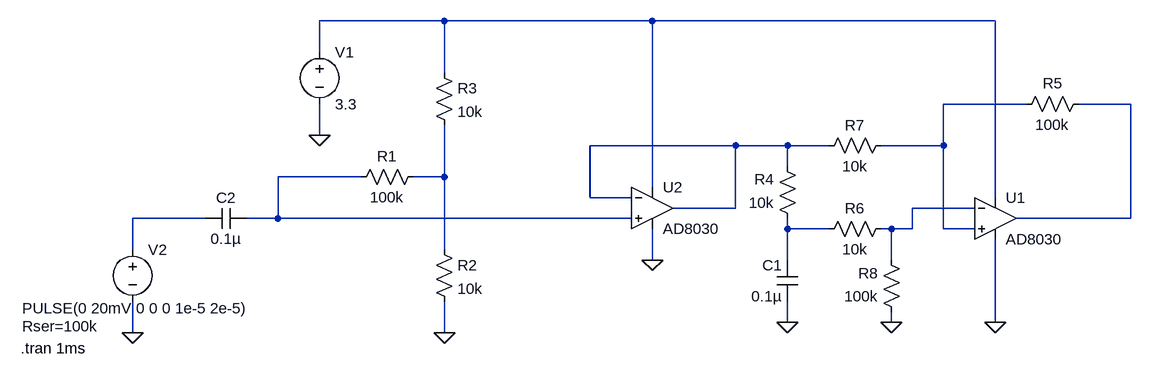
[diagram p0: schematic Draft1.asc]
Draft1.asc, the LTspice schematic file:
Version 4
SHEET 1 1160 680
WIRE -80 -112 -272 -112
WIRE 240 -112 -80 -112
WIRE 768 -112 240 -112
WIRE -272 -64 -272 -112
WIRE -80 -32 -80 -112
WIRE 816 16 688 16
WIRE 976 16 896 16
WIRE -272 64 -272 16
WIRE 368 80 144 80
WIRE 448 80 368 80
WIRE 512 80 448 80
WIRE 688 80 688 16
WIRE 688 80 592 80
WIRE 448 112 448 80
WIRE -208 128 -336 128
WIRE -80 128 -80 48
WIRE -80 128 -128 128
WIRE 240 144 240 -112
WIRE 144 160 144 80
WIRE 208 160 144 160
WIRE 768 160 768 -112
WIRE 368 176 368 80
WIRE 368 176 272 176
WIRE 736 176 640 176
WIRE -448 192 -560 192
WIRE -336 192 -336 128
WIRE -336 192 -384 192
WIRE 208 192 -336 192
WIRE 976 192 976 16
WIRE 976 192 800 192
WIRE 448 208 448 192
WIRE 512 208 448 208
WIRE 608 208 592 208
WIRE 640 208 640 176
WIRE 640 208 608 208
WIRE 688 208 688 80
WIRE 736 208 688 208
WIRE -560 240 -560 192
WIRE -80 240 -80 128
WIRE 240 256 240 208
WIRE 448 256 448 208
WIRE 608 256 608 208
WIRE 448 352 448 320
WIRE 608 352 608 336
WIRE 768 352 768 224
WIRE -560 368 -560 320
WIRE -80 368 -80 320
FLAG -272 64 0
FLAG -560 368 0
FLAG -80 368 0
FLAG 240 256 0
FLAG 768 352 0
FLAG 448 352 0
FLAG 608 352 0
SYMBOL res -96 224 R0
SYMATTR InstName R2
SYMATTR Value 10k
SYMBOL res -96 -48 R0
SYMATTR InstName R3
SYMATTR Value 10k
SYMBOL voltage -272 -80 R0
WINDOW 123 0 0 Left 0
WINDOW 39 0 0 Left 0
SYMATTR InstName V1
SYMATTR Value 3.3
SYMBOL voltage -560 224 R0
WINDOW 3 -170 106 Left 2
WINDOW 123 0 0 Left 0
WINDOW 39 -170 134 Left 2
SYMATTR InstName V2
SYMATTR Value PULSE(0 20mV 0 0 0 1e-5 2e-5)
SYMATTR SpiceLine Rser=100k
SYMBOL cap -384 176 R90
WINDOW 0 0 32 VBottom 2
WINDOW 3 32 32 VTop 2
SYMATTR InstName C2
SYMATTR Value 0.1µ
SYMBOL OpAmps\\AD8030 240 112 R0
SYMATTR InstName U2
SYMBOL res -112 112 R90
WINDOW 0 0 56 VBottom 2
WINDOW 3 32 56 VTop 2
SYMATTR InstName R1
SYMATTR Value 100k
SYMBOL OpAmps\\AD8030 768 128 R0
SYMATTR InstName U1
SYMBOL res 464 208 R180
WINDOW 0 36 76 Left 2
WINDOW 3 36 40 Left 2
SYMATTR InstName R4
SYMATTR Value 10k
SYMBOL res 912 0 R90
WINDOW 0 0 56 VBottom 2
WINDOW 3 32 56 VTop 2
SYMATTR InstName R5
SYMATTR Value 100k
SYMBOL res 608 192 R90
WINDOW 0 0 56 VBottom 2
WINDOW 3 32 56 VTop 2
SYMATTR InstName R6
SYMATTR Value 10k
SYMBOL res 608 64 R90
WINDOW 0 0 56 VBottom 2
WINDOW 3 32 56 VTop 2
SYMATTR InstName R7
SYMATTR Value 10k
SYMBOL cap 464 320 R180
WINDOW 0 24 56 Left 2
WINDOW 3 24 8 Left 2
SYMATTR InstName C1
SYMATTR Value 0.1µ
SYMBOL res 624 352 R180
WINDOW 0 36 76 Left 2
WINDOW 3 36 40 Left 2
SYMATTR InstName R8
SYMATTR Value 100k
TEXT -732 392 Left 2 !.tran 1ms

The netlist it stands for:
* Draft1.asc
R2 N006 0 10k
R3 N001 N006 10k
V1 N001 0 3.3
V2 N008 0 PULSE(0 20mV 0 0 0 1e-5 2e-5) Rser=100k
C2 N005 N008 0.1µ
XU2 N005 N004 N001 0 N004 AD8040  ; AD8030, pins In+ In- V+ V- OUT
R1 N006 N005 100k
XU1 N002 N007 N001 0 N003 AD8040  ; AD8030, pins In+ In- V+ V- OUT
R4 N009 N004 10k
R5 N003 N002 100k
R6 N007 N009 10k
R7 N002 N004 10k
C1 0 N009 0.1µ
R8 0 N007 100k
.tran 1ms
.lib ADI.lib
.backanno
.end